# Altium schematic sheet On-Screen-Display.SchDoc: On-Screen-Display
size A4; Author: Miłosz Werner; Organization: Wrocław University of Science and Technology; Revision: 1.0; SheetNumber: 5; SheetTotal: 5
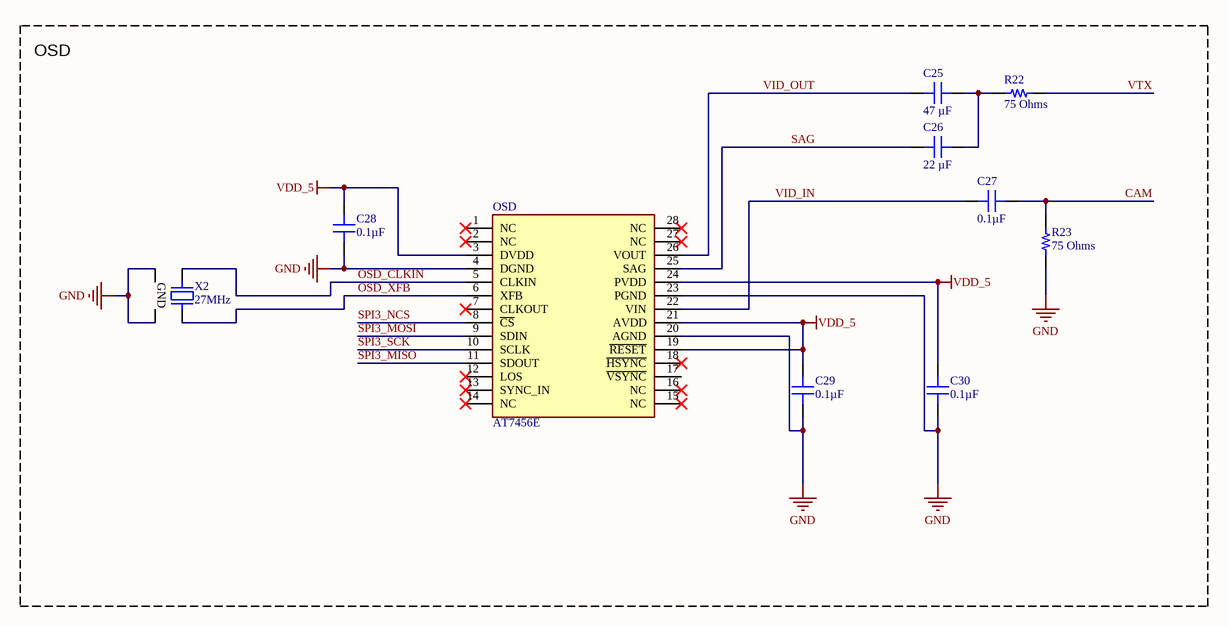
[diagram p0: On-Screen-Display.SchDoc]

## Parts
C25  47 µF  [CAP 0603_1608]
C26  22 µF  [CAP 0603_1608]
C27  0.1µF  [CAP 0603_1608]
C28  0.1µF  [CAP 0603_1608]
C29  0.1µF  [CAP 0603_1608]
C30  0.1µF  [CAP 0603_1608]
OSD  AT7456E  [SOP65P640X120-29N]
R22  75 Ohms  [RES 0603_1608]
R23  75 Ohms  [RES 0603_1608]
X2  27MHz  [ABRACON ABM10]

## Blocks framed on the sheet
OSD: C25-C30 OSD R22 R23 X2

## Nets
GND: C28.1 C29.1 C30.1 OSD.4(DGND) OSD.20(AGND) OSD.23(PGND) R23.1 X2.2(GND) X2.4(GND)
VDD_5: C28.2 C29.2 C30.2 OSD.3(DVDD) OSD.19(~{RESET}) OSD.21(AVDD) OSD.24(PVDD)
CAM: C27.1 R23.2
OSD_CLKIN: OSD.5(CLKIN) X2.1
OSD_XFB: OSD.6(XFB) X2.3
SAG: C26.1 OSD.25(SAG)
SPI3_MISO: OSD.11(SDOUT)
SPI3_MOSI: OSD.9(SDIN)
SPI3_NCS: OSD.8(~{CS})
SPI3_SCK: OSD.10(SCLK)
VID_IN: C27.2 OSD.22(VIN)
VID_OUT: C25.1 OSD.26(VOUT)
VTX: R22.2
NetC25_2: C25.2 C26.2 R22.1

Not connected (* = marked no-connect by the designer): OSD 1(NC)* 2(NC)* 7(CLKOUT)* 12(LOS)* 13(SYNC_IN)* 14(NC)* 15(NC)* 16(NC)* 17(~{VSYNC}) 18(~{HSYNC})* 27(NC)* 28(NC)*

## Notes on the sheet
- Title:
- Date:
- File:
- Project:
- Organization:
- Size:
- A4
- Author:
- Sheet
- Of
- Revision:

## Library data of the parts
C25 = GRM188R60J476ME15D: CAP CER 47UF 6.3V X5R 0603; manufacturer: Murata Electronics; Tolerance: ±20%; Part Number: GRM188R60J476ME15D; Value: 47 µF; Applications: General Purpose; Capacitance: 47 µF; componentlink1description: Datasheet; componentlink1url: https://www.murata.com/~/media/webrenewal/support/library/catalog/products/capacitor/mlcc/c02e.ashx?la=en-us; componentlink2description: DigiKey Link; componentlink2url: https://www.digikey.com/en/products/detail/murata-electronics/GRM188R60J476ME15D/5877410; Device Package: 0603 (1608 Metric); lastupdated: 19.09.2022 13:01:11; Lifecycle Status: Active; Minimum Order: 1; Mounting Type: Surface Mount, MLCC; Operating Temperature: -55°C ~ 85°C; Package / Case: 0603 (1608 Metric); packaging: TapeAndReel; partid: 5468; Part Status: Active; price: 0.10; series: GRM; Size / Dimension: 0.063" L x 0.031" W (1.60mm x 0.80mm); Supplier 1: DigiKey; Supplier Part Number 1: 490-13247-1-ND; Temperature Coefficient: X5R; Thickness (Max): 0.039" (1.00mm); Voltage - Rated: 6.3V
C26 = GRM186R60J226ME15D: CAP CER 22UF 6.3V X5R 0603; manufacturer: Murata Electronics; Tolerance: ±20%; Part Number: GRM186R60J226ME15D; Value: 22 µF; Applications: General Purpose; Capacitance: 22 µF; componentlink1description: Datasheet; componentlink1url: https://psearch.en.murata.com/capacitor/product/GRM186R60J226ME15%23.pdf; componentlink2description: DigiKey Link; componentlink2url: https://www.digikey.com/en/products/detail/murata-electronics/GRM186R60J226ME15D/5877404; Device Package: 0603 (1608 Metric); lastupdated: 19.09.2022 13:01:20; Lifecycle Status: Active; Minimum Order: 1; Mounting Type: Surface Mount, MLCC; Operating Temperature: -55°C ~ 85°C; Package / Case: 0603 (1608 Metric); packaging: TapeAndReel; partid: 2353; Part Status: Active; price: 0.06; series: GRM; Size / Dimension: 0.063" L x 0.031" W (1.60mm x 0.80mm); Supplier 1: DigiKey; Supplier Part Number 1: 490-13241-1-ND; Temperature Coefficient: X5R; Thickness (Max): 0.024" (0.60mm); Voltage - Rated: 6.3V
C27-C30 = 06033C104JAT4A: CAP CER 0.1UF 25V X7R 0603; manufacturer: AVX Corporation; Tolerance: ±5%; Part Number: 06033C104JAT4A; Value: 0.1µF; Applications: General Purpose; Capacitance: 0.1µF; componentlink1description: Datasheet; componentlink1url: http://datasheets.avx.com/X7RDielectric.pdf; componentlink2description: DigiKey Link; componentlink2url: http://digikey.com/product-detail/en/avx-corporation/06033C104JAT4A/478-11510-1-ND/8107711; Device Package: 0603 (1608 Metric); lastupdated: 02.09.2020 01:03:22; Lifecycle Status: Active; Minimum Order: 1; Mounting Type: Surface Mount, MLCC; Operating Temperature: -55°C ~ 125°C; Package / Case: 0603 (1608 Metric); packaging: TapeAndReel; partid: 10083; Part Status: Active; price: 0.06; series: -; Size / Dimension: 0.063" L x 0.032" W (1.60mm x 0.81mm); Supplier 1: DigiKey; Supplier Part Number 1: 478-11510-1-ND; Temperature Coefficient: X7R; Thickness (Max): 0.035" (0.90mm); Voltage - Rated: 25V
OSD = AT7456E: Integrated Circuit; Manufacturer_Name: ICOF; Datasheet Link: https://datasheet.lcsc.com/szlcsc/ZHONGKEWEI-AT7456E_C82351.pdf; Height: 1.2mm; Manufacturer_Part_Number: AT7456E
R22 R23 = RNCP0603FTD75R0: RES 75 OHM 1% 1/8W 0603; Manufacturer: Stackpole Electronics Inc; Power (Watts): 0.125W, 1/8W; Temperature Coefficient: ±100ppm/°C; Part Number: RNCP0603FTD75R0; Value: 75 Ohms; ComponentLink1Description: Datasheet; ComponentLink1URL: https://www.seielect.com/catalog/sei-rncp.pdf; ComponentLink2Description: DigiKey Link; ComponentLink2URL: https://www.digikey.com/en/products/detail/stackpole-electronics-inc/RNCP0603FTD75R0/2240084; Composition: Thin Film; Device Package: 0603 (1608 Metric); Features: Anti-Sulfur; Height - Seated (Max): 0.022" (0.55mm); LastUpdated: 19.09.2022 13:22:31; Lifecycle Status: Active; Minimum Order: 1; Number of Terminations: 2; Operating Temperature: -55°C ~ 155°C; Package / Case: 0603 (1608 Metric); Packaging: TapeAndReel; PartId: 5698; Part Status: Active; Price: 0.01; Resistance: 75 Ohms; Series: RNCP; Size / Dimension: 0.061" L x 0.031" W (1.55mm x 0.80mm); Supplier 1: DigiKey; Supplier Part Number 1: RNCP0603FTD75R0CT-ND; Supplier Device Package: 0603; Tolerance: ±1%
X2 = ABM10-27.000MHZ-D30-T3: CRYSTAL 27.0000MHZ 10PF SMD; Manufacturer: Abracon LLC; ESR (Equivalent Series Resistance): 100 Ohms; Frequency Stability: ±30ppm; Frequency Tolerance: ±20ppm; Operating Mode: Fundamental; Part Number: ABM10-27.000MHZ-D30-T3; ComponentLink1Description: Datasheet; ComponentLink1URL: https://abracon.com/Resonators/ABM10.pdf; ComponentLink2Description: DigiKey Link; ComponentLink2URL: http://digikey.com/product-detail/en/abracon-llc/ABM10-27.000MHZ-D30-T3/535-10934-1-ND/2624185; Device Package: 4-SMD, No Lead; Frequency: 27MHz; Height - Seated (Max): 0.028" (0.70mm); LastUpdated: 19.03.2020 22:27:46; Lifecycle Status: Active; Load Capacitance: 10pF; Minimum Order: 1; Mounting Type: Surface Mount; Operating Temperature: -40°C ~ 85°C; Package / Case: 4-SMD, No Lead; Packaging: TapeAndReel; PartId: 274; Part Status: Active; Price: 0.67; Series: ABM10; Size / Dimension: 0.098" L x 0.079" W (2.50mm x 2.00mm); Supplier 1: DigiKey; Supplier Part Number 1: 535-10934-1-ND; Type: MHz Crystal; Value: 27MHz